# Altium schematic sheet MMU.schdoc
size 722 x 363 mm
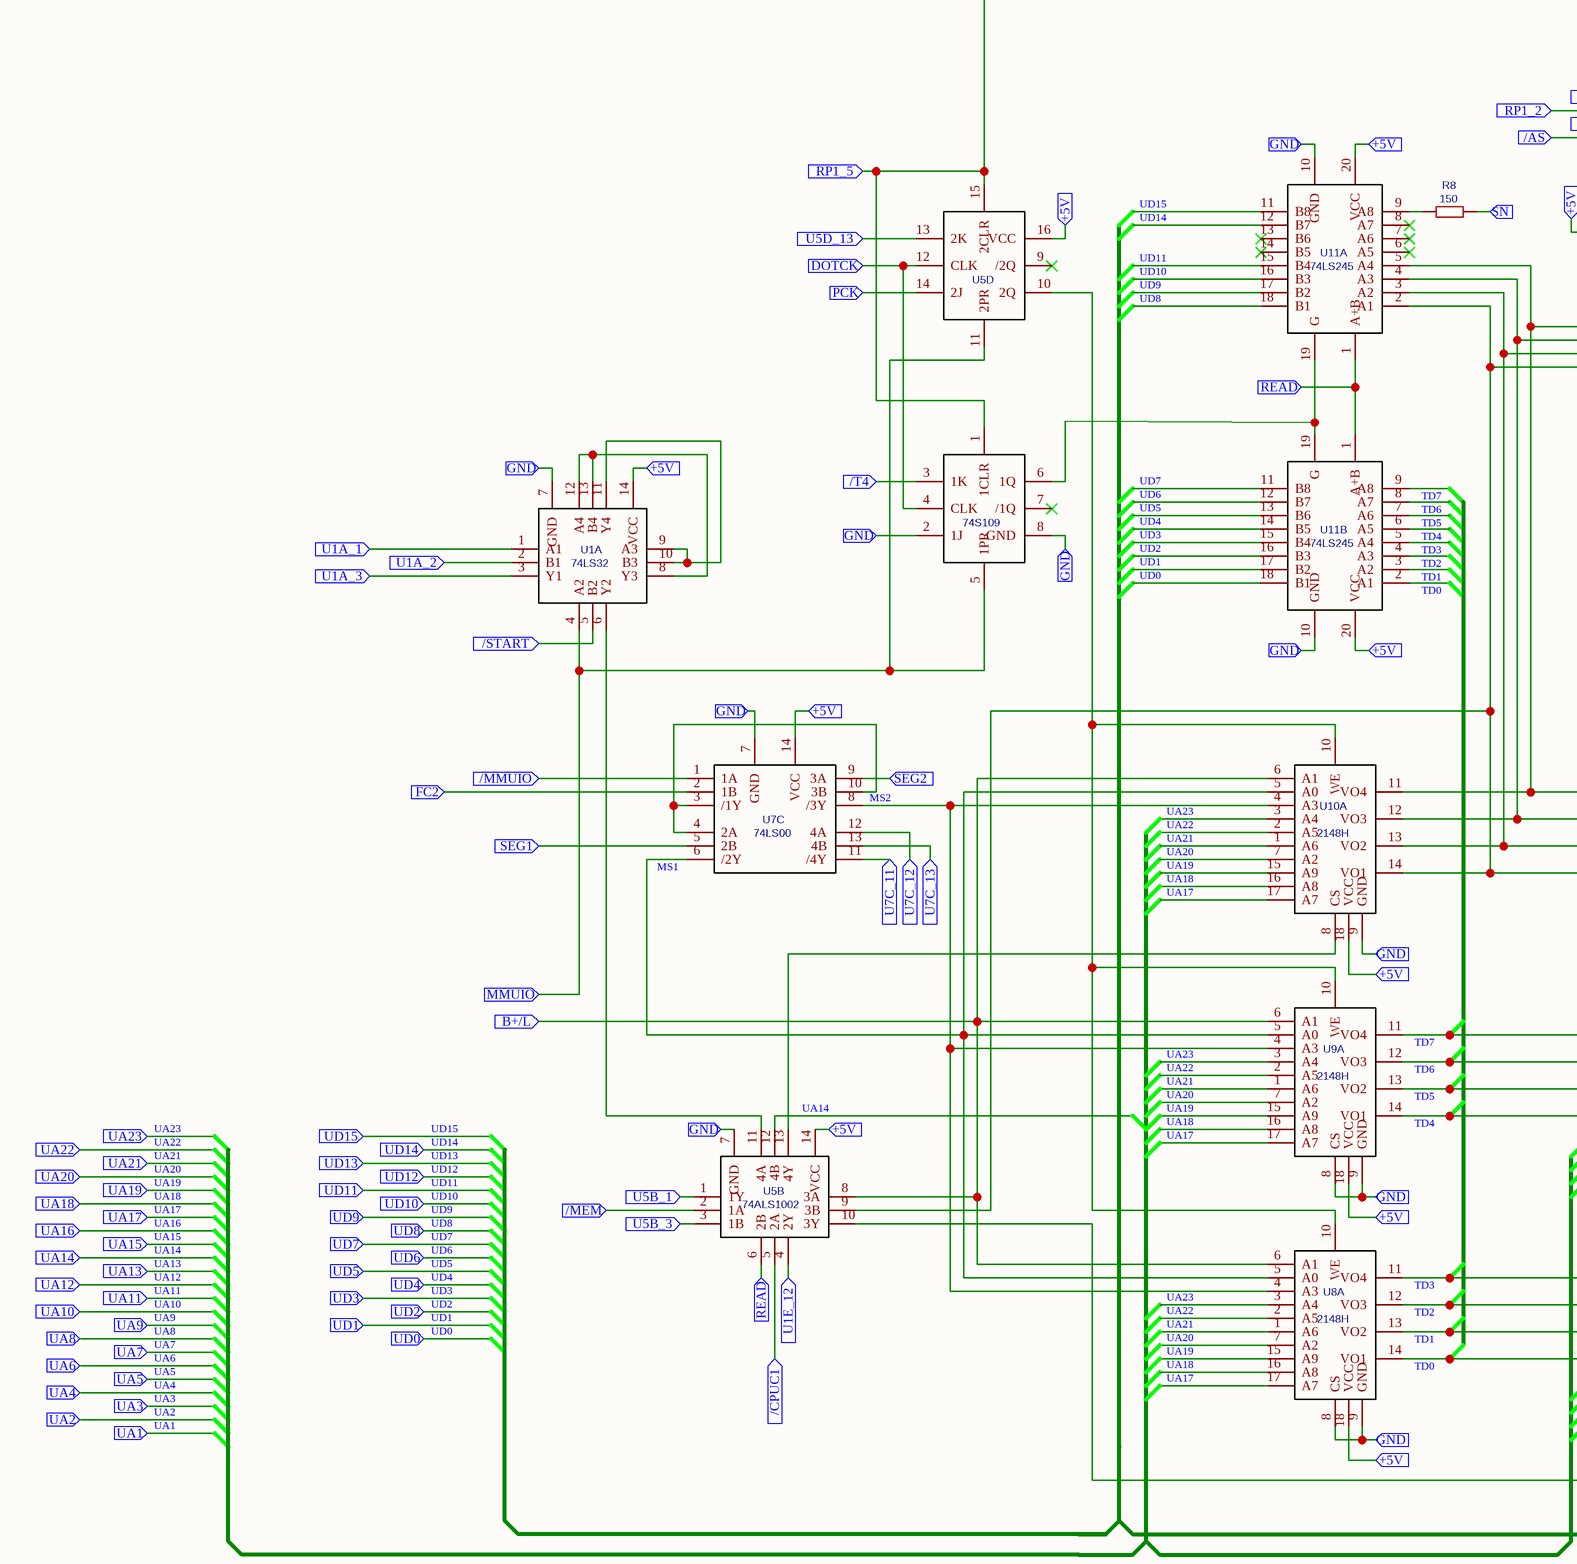
[diagram p0: MMU.schdoc, left]
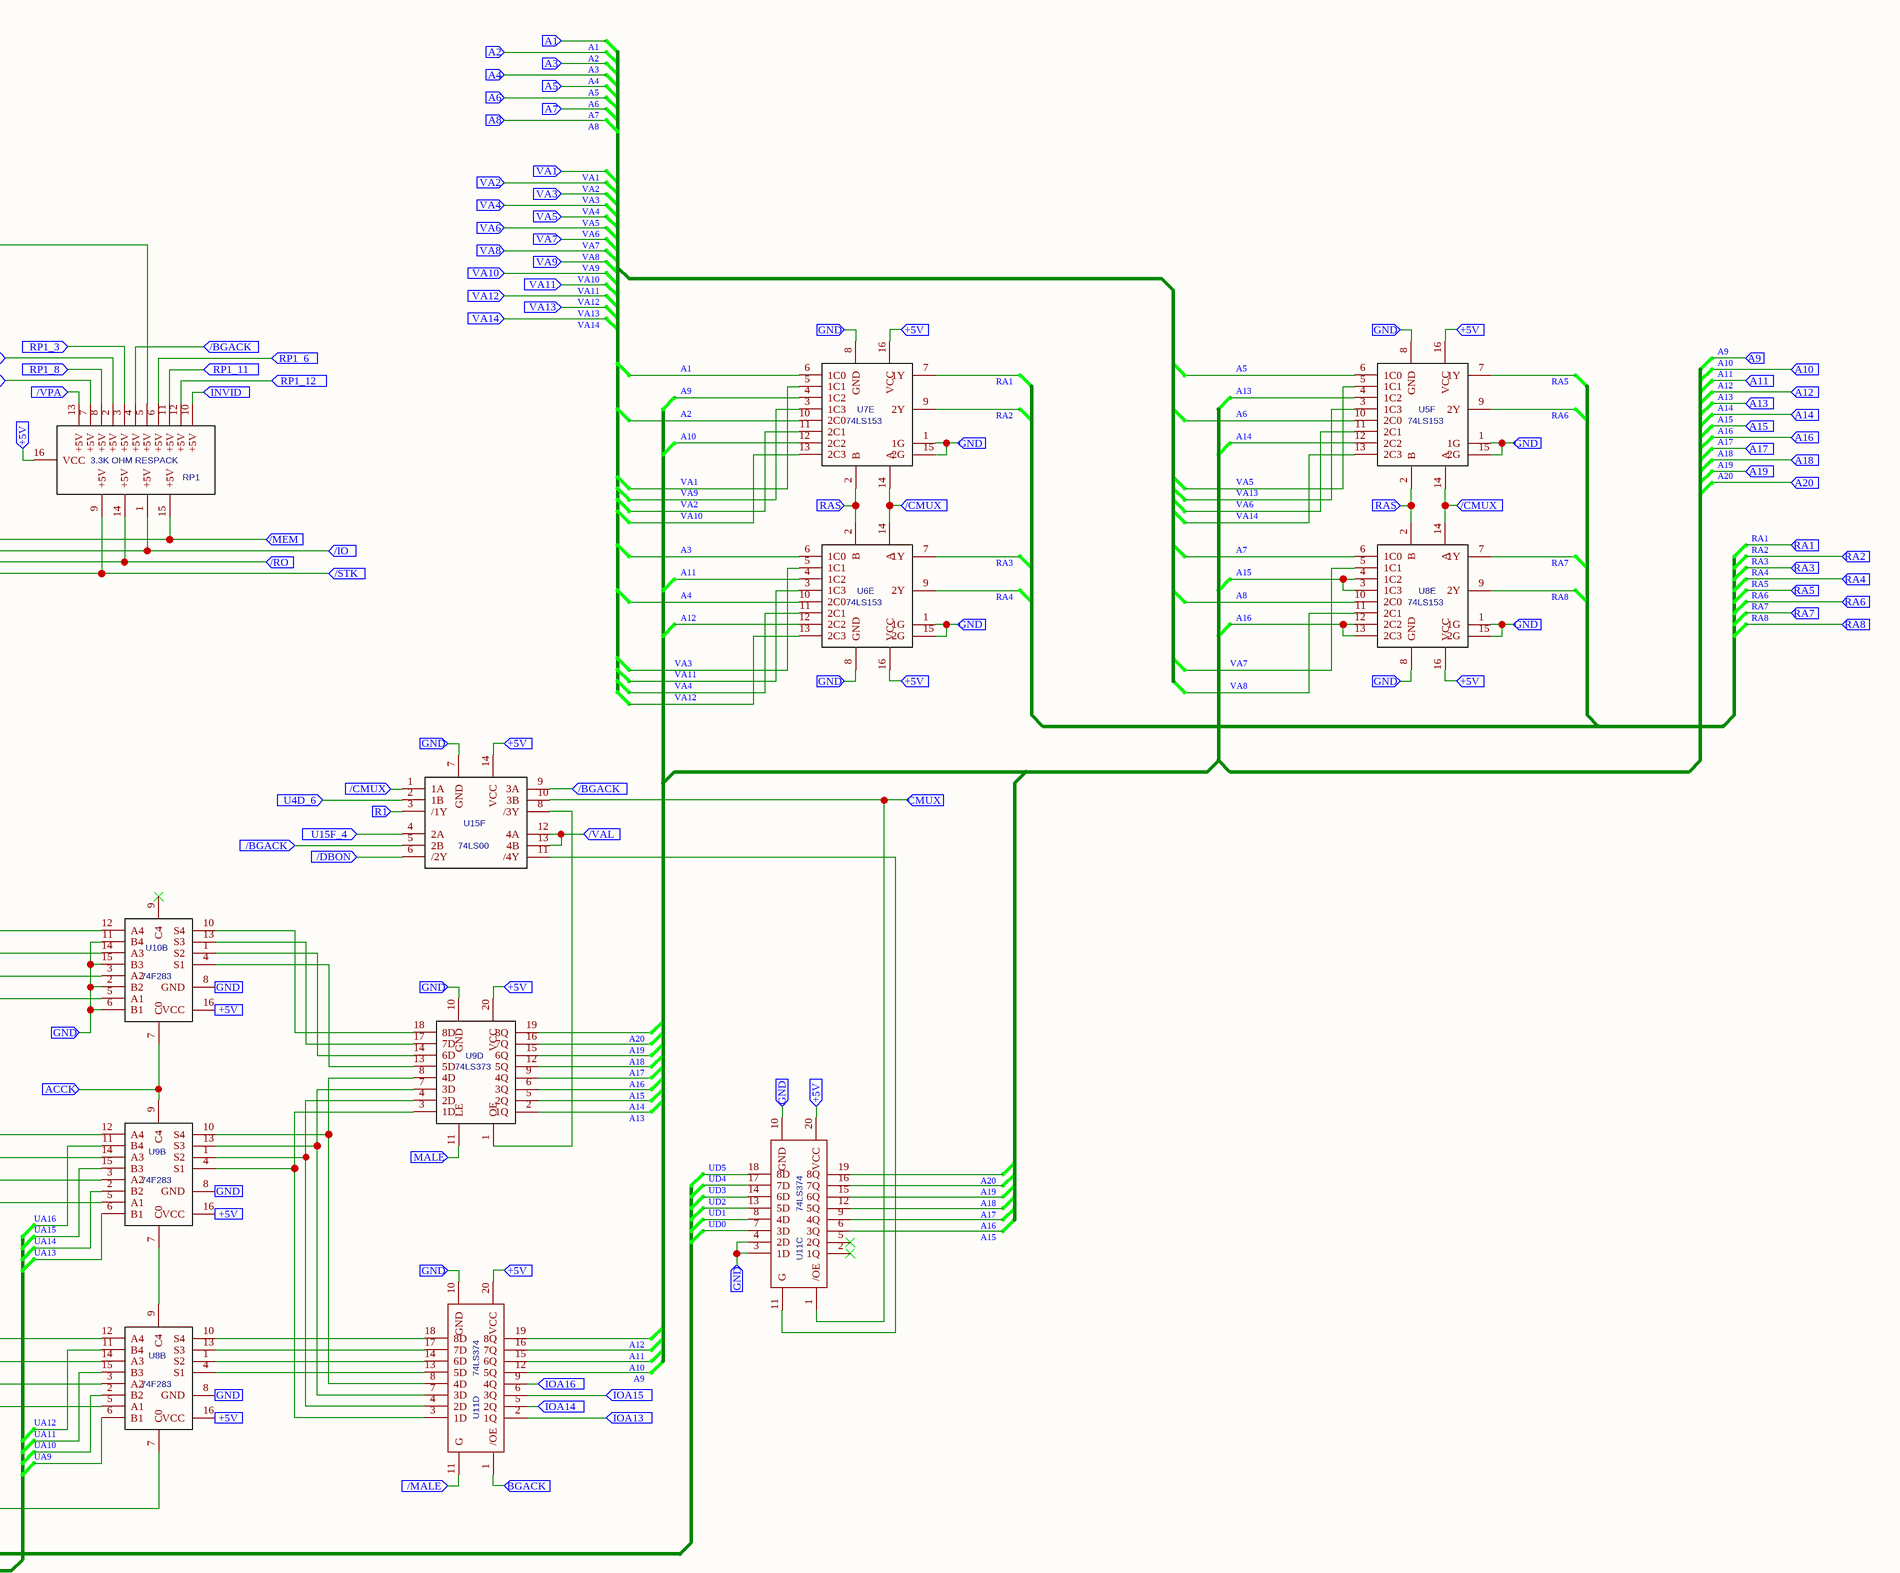
[diagram p1: MMU.schdoc, right]

## Parts
R8  150  [LISA_RESISTOR]
RP1  3.3K OHM RESPACK  [LISA_DIP_16]
U1A  74LS32  [LISA_DIP_14]
U5B  74ALS1002  [LISA_DIP_14]
U5D  74S109  [LISA_DIP_16]
U5F  74LS153  [LISA_DIP_16]
U6E  74LS153  [LISA_DIP_16]
U7C  74LS00  [LISA_DIP_14]
U7E  74LS153  [LISA_DIP_16]
U8A  2148H  [LISA_DIP_18]
U8B  74F283  [LISA_DIP_16]
U8E  74LS153  [LISA_DIP_16]
U9A  2148H  [LISA_DIP_18]
U9B  74F283  [LISA_DIP_16]
U9D  74LS373  [LISA_DIP_20]
U10A  2148H  [LISA_DIP_18]
U10B  74F283  [LISA_DIP_16]
U11A  74LS245  [LISA_DIP_20]
U11B  74LS245  [LISA_DIP_20]
U11C  74LS374  [LISA_DIP_20]
U11D  74LS374  [LISA_DIP_20]
U15F  74LS00  [LISA_DIP_14]

## Ports
+5V (in), /AS (in), /BGACK (in), /CMUX (in), /CPUC1 (in), /DBON (in), /IO (in), /MALE (in), /MEM (in), /MMUIO (in), /RO (in), /START (in), /STK (in), /T4 (in), /VAL (in), /VPA (in), A1 (in), A2 (in), A3 (in), A4 (in), A5 (in), A6 (in), A7 (in), A8 (in), A9 (in), A10 (in), A11 (in), A12 (in), A13 (in), A14 (in), A15 (in), A16 (in), A17 (in), A18 (in), A19 (in), A20 (in), ACCK (in), B+/L (in), BGACK (in), CMUX (in), DOTCK (in), FC2 (in), GND (in), INVID (in), IOA13 (in), IOA14 (in), IOA15 (in), IOA16 (in), MALE (in), MMUIO (in), PCK (in), R1 (in), RA1 (in), RA2 (in), RA3 (in), RA4 (in), RA5 (in), RA6 (in), RA7 (in), RA8 (in), RAS (in), READ (in), RP1_2 (in), RP1_3 (in), RP1_5 (in), RP1_6 (in), RP1_8 (in), RP1_11 (in), RP1_12 (in), SEG1 (in), SEG2 (in), SN (in), U1A_1 (in), U1A_2 (in), U1A_3 (in), U1E_12 (in), U4D_6 (in), U5B_1 (in), U5B_3 (in), U5D_13 (in), U7C_11 (in), U7C_12 (in), U7C_13 (in), U15F_4 (in), UA1 (in), UA2 (in), UA3 (in), UA4 (in), UA5 (in), UA6 (in), UA7 (in), UA8 (in), UA9 (in), UA10 (in), UA11 (in), UA12 (in), UA13 (in), UA14 (in), UA15 (in), UA16 (in), UA17 (in), UA18 (in), UA19 (in), UA20 (in), UA21 (in), UA22 (in), UA23 (in), UD0 (in), UD1 (in), UD2 (in), UD3 (in), UD4 (in), UD5 (in), UD6 (in), UD7 (in), UD8 (in), UD9 (in), UD10 (in), UD11 (in), UD12 (in), UD13 (in), UD14 (in), UD15 (in), VA1 (in), VA2 (in), VA3 (in), VA4 (in), VA5 (in), VA6 (in), VA7 (in), VA8 (in), VA9 (in), VA10 (in), VA11 (in), VA12 (in), VA13 (in), VA14 (in)

## Nets
+5V: RP1.16(VCC) U1A.14(VCC) U5B.14(VCC) U5D.16(VCC) U5F.16(VCC) U6E.16(VCC) U7C.14(VCC) U7E.16(VCC) U8A.18(VCC) U8B.16(VCC) U8E.16(VCC) U9A.18(VCC) U9B.16(VCC) U9D.20(VCC) U10A.18(VCC) U10B.16(VCC) U11A.20(VCC) U11B.20(VCC) U11C.20(VCC) U11D.20(VCC) U15F.14(VCC) ; port +5V
/AS: RP1.7(+5V) ; port /AS
/BGACK: RP1.4(+5V) U15F.5(2B) U15F.9(3A) ; port /BGACK
/CMUX: U5F.14(A) U6E.14(A) U7E.14(A) U8E.14(A) U15F.1(1A) ; port /CMUX
/CPUC1: U5B.5(2A) ; port /CPUC1
/DBON: U15F.6(/2Y) ; port /DBON
/IO: RP1.1(+5V) U10A.12(VO3) U10B.14(A3) U11A.4(A3) ; port /IO
/MALE: U11D.11(G) ; port /MALE
/MEM: RP1.15(+5V) U5B.2(1A) U10A.11(VO4) U10B.12(A4) U11A.5(A4) ; port /MEM
/MMUIO: U7C.1(1A) ; port /MMUIO
/RO: RP1.14(+5V) U10A.13(VO2) U10B.3(A2) U11A.3(A2) ; port /RO
/START: U1A.5(B2) ; port /START
/STK: RP1.9(+5V) U5B.9(3B) U10A.14(VO1) U10B.5(A1) U11A.2(A1) ; port /STK
/T4: U5D.3(1K) ; port /T4
/VAL: U15F.12(4A) U15F.13(4B) ; port /VAL
/VPA: RP1.13(+5V) ; port /VPA
A1: U7E.6(1C0) ; port A1
A2: U7E.10(2C0) ; port A2
A3: U6E.6(1C0) ; port A3
A4: U6E.10(2C0) ; port A4
A5: U5F.6(1C0) ; port A5
A6: U5F.10(2C0) ; port A6
A7: U8E.6(1C0) ; port A7
A8: U8E.10(2C0) ; port A8
A9: U7E.4(1C2) U11D.12(5Q) ; port A9
A10: U7E.12(2C2) U11D.15(6Q) ; port A10
A11: U6E.4(1C2) U11D.16(7Q) ; port A11
A12: U6E.12(2C2) U11D.19(8Q) ; port A12
A13: U5F.4(1C2) U9D.2(1Q) ; port A13
A14: U5F.12(2C2) U9D.5(2Q) ; port A14
A15: U8E.3(1C3) U8E.4(1C2) U9D.6(3Q) U11C.6(3Q) ; port A15
A16: U8E.12(2C2) U8E.13(2C3) U9D.9(4Q) U11C.9(4Q) ; port A16
A17: U9D.12(5Q) U11C.12(5Q) ; port A17
A18: U9D.15(6Q) U11C.15(6Q) ; port A18
A19: U9D.16(7Q) U11C.16(7Q) ; port A19
A20: U9D.19(8Q) U11C.19(8Q) ; port A20
ACCK: U9B.9(C4) U10B.7(C0) ; port ACCK
B+/L: U5B.8(3A) U8A.6(A1) U9A.6(A1) U10A.6(A1) ; port B+/L
BGACK: U11D.1(/OE) ; port BGACK
CMUX: U11C.1(/OE) U15F.10(3B) ; port CMUX
DOTCK: U5D.4(CLK) U5D.12(CLK) ; port DOTCK
FC2: U7C.2(1B) ; port FC2
GND: U1A.7(GND) U5B.7(GND) U5D.2(1J) U5D.8(GND) U5F.1(1G) U5F.8(GND) U5F.15(2G) U6E.1(1G) U6E.8(GND) U6E.15(2G) U7C.7(GND) U7E.1(1G) U7E.8(GND) U7E.15(2G) U8A.8(CS) U8A.9(GND) U8B.8(GND) U8E.1(1G) U8E.8(GND) U8E.15(2G) U9A.8(CS) U9A.9(GND) U9B.8(GND) U9D.10(GND) U10A.9(GND) U10B.2(B2) U10B.6(B1) U10B.8(GND) U10B.11(B4) U10B.15(B3) U11A.10(GND) U11B.10(GND) U11C.3(1D) U11C.4(2D) U11C.10(GND) U11D.10(GND) U15F.7(GND) ; port GND
INVID: RP1.10(+5V) ; port INVID
IOA13: U11D.2(1Q) ; port IOA13
IOA14: U11D.5(2Q) ; port IOA14
IOA15: U11D.6(3Q) ; port IOA15
IOA16: U11D.9(4Q) ; port IOA16
MALE: U9D.11(LE) ; port MALE
MMUIO: U1A.4(A2) U5D.5(1PR) U5D.11(2PR) ; port MMUIO
MS1: U7C.6(/2Y) U8A.5(A0) U9A.5(A0) U10A.5(A0)
MS2: U7C.8(/3Y) U8A.4(A3) U9A.4(A3) U10A.4(A3)
PCK: U5D.14(2J) ; port PCK
R1: U15F.3(/1Y) ; port R1
RA1: U7E.7(1Y) ; port RA1
RA2: U7E.9(2Y) ; port RA2
RA3: U6E.7(1Y) ; port RA3
RA4: U6E.9(2Y) ; port RA4
RA5: U5F.7(1Y) ; port RA5
RA6: U5F.9(2Y) ; port RA6
RA7: U8E.7(1Y) ; port RA7
RA8: U8E.9(2Y) ; port RA8
RAS: U5F.2(B) U6E.2(B) U7E.2(B) U8E.2(B) ; port RAS
READ: U5B.6(2B) U11A.1(A+B) U11B.1(A+B) ; port READ
RP1_2: RP1.2(+5V) ; port RP1_2
RP1_3: RP1.3(+5V) ; port RP1_3
RP1_5: RP1.5(+5V) U5D.1(1CLR) U5D.15(2CLR) ; port RP1_5
RP1_6: RP1.6(+5V) ; port RP1_6
RP1_8: RP1.8(+5V) ; port RP1_8
RP1_11: RP1.11(+5V) ; port RP1_11
RP1_12: RP1.12(+5V) ; port RP1_12
SEG1: U7C.5(2B) ; port SEG1
SEG2: U7C.9(3A) ; port SEG2
SN: R8.1 ; port SN
TD0: U8A.14(VO1) U8B.5(A1) U11B.2(A1)
TD1: U8A.13(VO2) U8B.3(A2) U11B.3(A2)
TD2: U8A.12(VO3) U8B.14(A3) U11B.4(A3)
TD3: U8A.11(VO4) U8B.12(A4) U11B.5(A4)
TD4: U9A.14(VO1) U9B.5(A1) U11B.6(A5)
TD5: U9A.13(VO2) U9B.3(A2) U11B.7(A6)
TD6: U9A.12(VO3) U9B.14(A3) U11B.8(A7)
TD7: U9A.11(VO4) U9B.12(A4) U11B.9(A8)
U1A_1: U1A.1(A1) ; port U1A_1
U1A_2: U1A.2(B1) ; port U1A_2
U1A_3: U1A.3(Y1) ; port U1A_3
U1E_12: U5B.4(2Y) ; port U1E_12
U4D_6: U15F.2(1B) ; port U4D_6
U5B_1: U5B.1(1Y) ; port U5B_1
U5B_3: U5B.3(1B) ; port U5B_3
U5D_13: U5D.13(2K) ; port U5D_13
U7C_11: U7C.11(/4Y) ; port U7C_11
U7C_12: U7C.12(4A) ; port U7C_12
U7C_13: U7C.13(4B) ; port U7C_13
U15F_4: U15F.4(2A) ; port U15F_4
UA1: port UA1
UA2: port UA2
UA3: port UA3
UA4: port UA4
UA5: port UA5
UA6: port UA6
UA7: port UA7
UA8: port UA8
UA9: U8B.6(B1) ; port UA9
UA10: U8B.2(B2) ; port UA10
UA11: U8B.15(B3) ; port UA11
UA12: U8B.11(B4) ; port UA12
UA13: U9B.6(B1) ; port UA13
UA14: U5B.12(4B) U9B.2(B2) ; port UA14
UA15: U9B.15(B3) ; port UA15
UA16: U9B.11(B4) ; port UA16
UA17: U8A.17(A7) U9A.17(A7) U10A.17(A7) ; port UA17
UA18: U8A.16(A8) U9A.16(A8) U10A.16(A8) ; port UA18
UA19: U8A.15(A9) U9A.15(A9) U10A.15(A9) ; port UA19
UA20: U8A.7(A2) U9A.7(A2) U10A.7(A2) ; port UA20
UA21: U8A.1(A6) U9A.1(A6) U10A.1(A6) ; port UA21
UA22: U8A.2(A5) U9A.2(A5) U10A.2(A5) ; port UA22
UA23: U8A.3(A4) U9A.3(A4) U10A.3(A4) ; port UA23
UD0: U11B.18(B1) U11C.7(3D) ; port UD0
UD1: U11B.17(B2) U11C.8(4D) ; port UD1
UD2: U11B.16(B3) U11C.13(5D) ; port UD2
UD3: U11B.15(B4) U11C.14(6D) ; port UD3
UD4: U11B.14(B5) U11C.17(7D) ; port UD4
UD5: U11B.13(B6) U11C.18(8D) ; port UD5
UD6: U11B.12(B7) ; port UD6
UD7: U11B.11(B8) ; port UD7
UD8: U11A.18(B1) ; port UD8
UD9: U11A.17(B2) ; port UD9
UD10: U11A.16(B3) ; port UD10
UD11: U11A.15(B4) ; port UD11
UD12: port UD12
UD13: port UD13
UD14: U11A.12(B7) ; port UD14
UD15: U11A.11(B8) ; port UD15
VA1: U7E.5(1C1) ; port VA1
VA2: U7E.11(2C1) ; port VA2
VA3: U6E.5(1C1) ; port VA3
VA4: U6E.11(2C1) ; port VA4
VA5: U5F.5(1C1) ; port VA5
VA6: U5F.11(2C1) ; port VA6
VA7: U8E.5(1C1) ; port VA7
VA8: U8E.11(2C1) ; port VA8
VA9: U7E.3(1C3) ; port VA9
VA10: U7E.13(2C3) ; port VA10
VA11: U6E.3(1C3) ; port VA11
VA12: U6E.13(2C3) ; port VA12
VA13: U5F.3(1C3) ; port VA13
VA14: U5F.13(2C3) ; port VA14
NetR8_2: R8.2 U11A.9(A8)
NetU1A_6: U1A.6(Y2) U5B.11(4A)
NetU1A_8: U1A.8(Y3) U1A.12(A4) U1A.13(B4)
NetU1A_9: U1A.9(A3) U1A.10(B3) U1A.11(Y4)
NetU5B_10: U5B.10(3Y) U8B.7(C0)
NetU5B_13: U5B.13(4Y) U10A.8(CS)
NetU5D_6: U5D.6(1Q) U11A.19(G) U11B.19(G)
NetU5D_10: U5D.10(2Q) U8A.10(WE) U9A.10(WE) U10A.10(WE)
NetU7C_3: U7C.3(/1Y) U7C.4(2A) U7C.10(3B)
NetU8B_1: U8B.1(S2) U11D.14(6D)
NetU8B_4: U8B.4(S1) U11D.13(5D)
NetU8B_9: U8B.9(C4) U9B.7(C0)
NetU8B_10: U8B.10(S4) U11D.18(8D)
NetU8B_13: U8B.13(S3) U11D.17(7D)
NetU9B_1: U9B.1(S2) U9D.4(2D) U11D.4(2D)
NetU9B_4: U9B.4(S1) U9D.3(1D) U11D.3(1D)
NetU9B_10: U9B.10(S4) U9D.8(4D) U11D.8(4D)
NetU9B_13: U9B.13(S3) U9D.7(3D) U11D.7(3D)
NetU9D_1: U9D.1(OE) U15F.8(/3Y)
NetU9D_13: U9D.13(5D) U10B.4(S1)
NetU9D_14: U9D.14(6D) U10B.1(S2)
NetU9D_17: U9D.17(7D) U10B.13(S3)
NetU9D_18: U9D.18(8D) U10B.10(S4)
NetU11C_11: U11C.11(G) U15F.11(/4Y)

Not connected (* = marked no-connect by the designer): U5D 7(/1Q)* 9(/2Q)*; U10B 9(C4)*; U11A 6(A5)* 7(A6)* 8(A7)* 13(B6)* 14(B5)*; U11C 2(1Q)* 5(2Q)*

## Library data of the parts
R8 = 150: Contributor: William Tooker; spicePre: R; spiceSymbolName: LISA_CPU_RESISTOR
RP1 = 3.3K OHM RESPACK: Contributor: William Tooker; spicePre: R; spiceSymbolName: LISA_CPU_RP1
U1A = 74LS32: Contributor: William Tooker; spicePre: U; spiceSymbolName: LISA_CPU_74LS32
U5B = 74ALS1002: Contributor: William Tooker; spicePre: U; spiceSymbolName: LISA_CPU_74ALS1002
U5D = 74S109: Contributor: William Tooker; spicePre: U; spiceSymbolName: LISA_CPU_74S109
U5F U6E U7E U8E = 74LS153: Contributor: William Tooker; spicePre: U
  U5F U7E: spiceSymbolName: LISA_CPU_74LS153_UPPER
  U6E U8E: spiceSymbolName: LISA_CPU_74LS153_LOWER
U7C U15F = 74LS00: Contributor: William Tooker; spicePre: U; spiceSymbolName: LISA_CPU_74LS00
U8A U9A U10A = 2148H: Contributor: William Tooker; spicePre: U; spiceSymbolName: LISA_CPU_2148H
U8B U9B U10B = 74F283: Contributor: will_tooker; spicePre: U; spiceSymbolName: LISA_CPU_74F283
U9D = 74LS373: Contributor: William Tooker; spicePre: U; spiceSymbolName: LISA_CPU_74LS373
U11A = 74LS245: Contributor: will_tooker; spicePre: U; spiceSymbolName: LISA_CPU_74LS245_U11A
U11B = 74LS245: Contributor: William Tooker; spicePre: U; spiceSymbolName: LISA_CPU_74LS245_U11B
U11C U11D = 74LS374: Contributor: William Tooker; spicePre: U; spiceSymbolName: LISA_CPU_74LS374